# EAGLE design merch-hat (EAGLE 9.2.0)
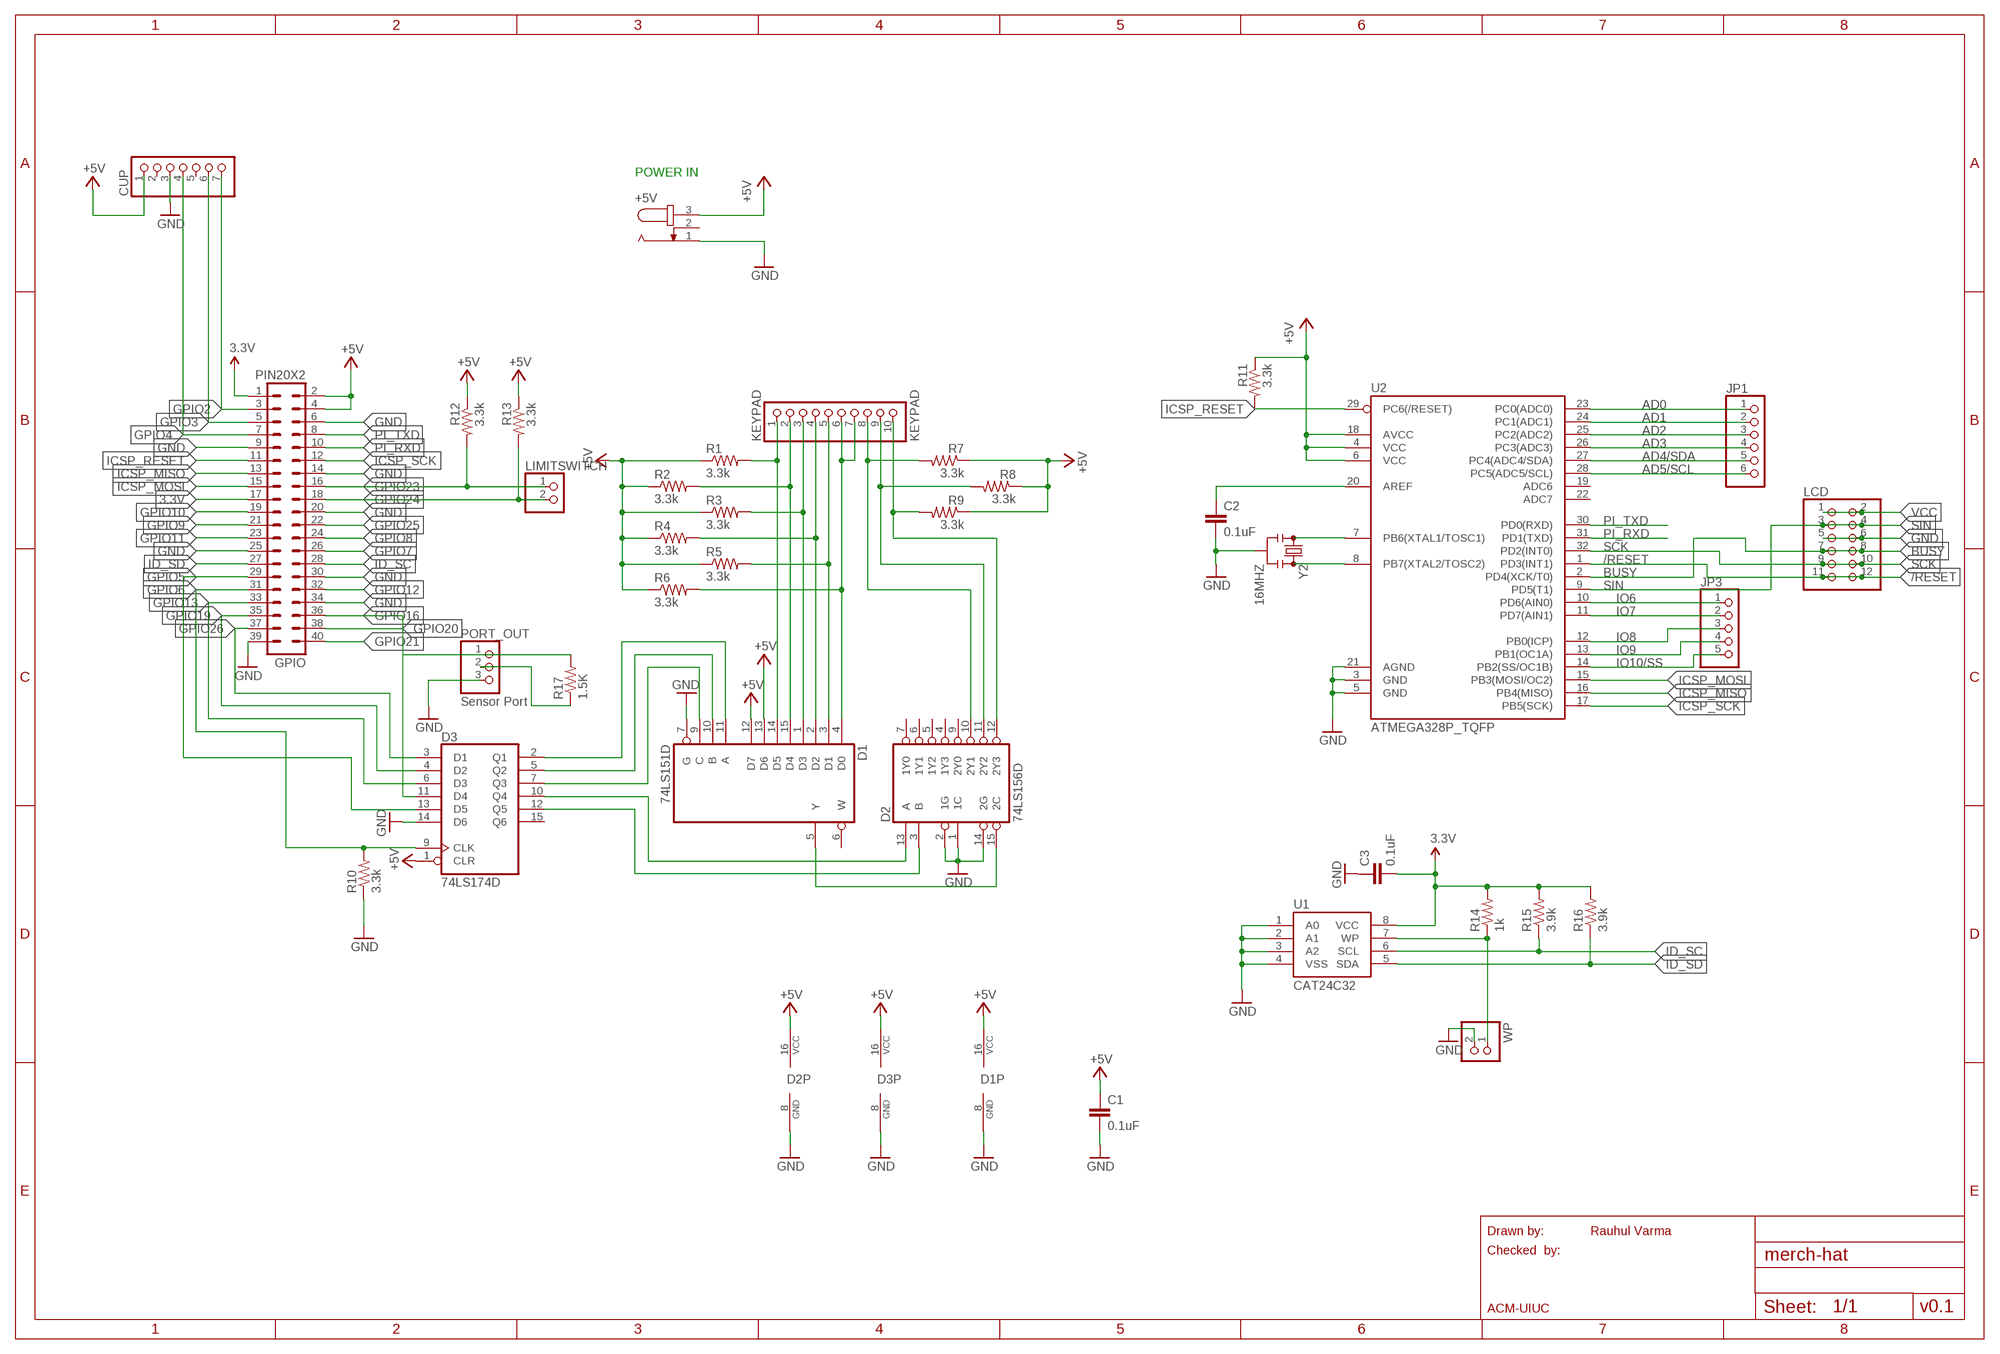
[diagram p0: schematic, sheet 1]

## Parts
+5V  JACK-PLUG1  [SPC4078]
C1  0.1uF  CAP0603-CAP  [0603-CAP]
C2  0.1uF  CAP0603-CAP  [0603-CAP]
C3  0.1uF  CAP0603-CAP  [0603-CAP]
CUP  PINHD-1X7  [1X07]
D1  74LS151D  [SO16]
D2  74LS156D  [SO16]
D3  74LS174D  [SO16]
GPIO  PIN20X2  [PIN_20X2]
JP1  PINHD-1X6  [1X06]
JP3  PINHD-1X5  [1X05]
KEYPAD  KEYPAD  PINHD-1X10  [1X10]
LCD  PINHD-2X6  [2X06]
LIMITSWITCH  PINHD-1X2  [1X02]
PORT_OUT  Sensor Port  PINHD-1X3  [1X03]
R1  3.3k  RESISTOR0603  [0603-RES]
R2  3.3k  RESISTOR0603  [0603-RES]
R3  3.3k  RESISTOR0603  [0603-RES]
R4  3.3k  RESISTOR0603  [0603-RES]
R5  3.3k  RESISTOR0603  [0603-RES]
R6  3.3k  RESISTOR0603  [0603-RES]
R7  3.3k  RESISTOR0603  [0603-RES]
R8  3.3k  RESISTOR0603  [0603-RES]
R9  3.3k  RESISTOR0603  [0603-RES]
R10  3.3k  RESISTOR0603  [0603-RES]
R11  3.3k  RESISTOR0603  [0603-RES]
R12  3.3k  RESISTOR0603  [0603-RES]
R13  3.3k  RESISTOR0603  [0603-RES]
R14  1k  RESISTOR0603-RES  [0603-RES]
R15  3.9k  RESISTOR0603-RES  [0603-RES]
R16  3.9k  RESISTOR0603-RES  [0603-RES]
R17  1.5K  R-US_R0603  [R0603]
U1  CAT24C32  [SO08]
U2  ATMEGA328P_TQFP  [TQFP32-08]
WP  PINHD-1X2  [1X02]
Y2  16MHZ  RESONATOR16MHZ  [RESONATOR-SMD]

## Nets
3.3V: C3.2 GPIO.1 GPIO.17 R14.2 R15.2 R16.2 U1.8(VCC)
+5V: +5V.3 C1.1 CUP.1 D1.12(D7) D1.13(D6) D1.16(VCC) D2.16(VCC) D3.1(CLR) D3.16(VCC) GPIO.2 GPIO.4 R1.1 R2.1 R3.1 R4.1 R5.1 R6.1 R7.1 R8.1 R9.1 R11.1 R12.1 R13.1 U2.4(VCC) U2.6(VCC) U2.18(AVCC)
/RESET: LCD.11 LCD.12 U2.1(PD3(INT1))
AD0: JP1.1 U2.23(PC0(ADC0))
AD1: JP1.2 U2.24(PC1(ADC1))
AD2: JP1.3 U2.25(PC2(ADC2))
AD3: JP1.4 U2.26(PC3(ADC3))
AD4/SDA: JP1.5 U2.27(PC4(ADC4/SDA))
AD5/SCL: JP1.6 U2.28(PC5(ADC5/SCL))
BUSY: LCD.7 LCD.8 U2.2(PD4(XCK/T0))
GND: +5V.1 C1.2 C2.2 C3.1 CUP.3 D1.7(G) D1.8(GND) D2.1(1C) D2.2(1G) D2.8(GND) D2.14(2G) D3.8(GND) D3.14(D6) GPIO.6 GPIO.9 GPIO.14 GPIO.20 GPIO.25 GPIO.30 GPIO.34 GPIO.39 LCD.5 LCD.6 PORT_OUT.3 R10.1 U1.1(A0) U1.2(A1) U1.3(A2) U1.4(VSS) U2.3(GND) U2.5(GND) U2.21(AGND) WP.2 Y2.2
GPIO2: CUP.7 GPIO.3
GPIO3: CUP.6 GPIO.5
GPIO4: CUP.4 GPIO.7
GPIO5: D3.13(D5) GPIO.29
GPIO6: D3.9(CLK) GPIO.31 R10.2
GPIO7: GPIO.26
GPIO8: GPIO.24
GPIO9: GPIO.21
GPIO10: GPIO.19
GPIO11: GPIO.23
GPIO12: GPIO.32
GPIO13: D3.6(D3) GPIO.33
GPIO16: D3.11(D4) GPIO.36
GPIO19: D3.4(D2) GPIO.35
GPIO20: GPIO.38 PORT_OUT.1 R17.2
GPIO21: GPIO.40
GPIO23: GPIO.16 LIMITSWITCH.1 R12.2
GPIO24: GPIO.18 LIMITSWITCH.2 R13.2
GPIO25: GPIO.22
GPIO26: D3.3(D1) GPIO.37
ICSP_MISO: GPIO.13 U2.16(PB4(MISO))
ICSP_MOSI: GPIO.15 U2.15(PB3(MOSI/OC2))
ICSP_RESET: GPIO.11 R11.2 U2.29(PC6(/RESET))
ICSP_SCK: GPIO.12 U2.17(PB5(SCK))
ID_SC: GPIO.28 R15.1 U1.6(SCL)
ID_SD: GPIO.27 R16.1 U1.5(SDA)
IO6: JP3.1 U2.10(PD6(AIN0))
IO7: JP3.2 U2.11(PD7(AIN1))
IO8: JP3.3 U2.12(PB0(ICP))
IO9: JP3.4 U2.13(PB1(OC1A))
IO10/SS: JP3.5 U2.14(PB2(SS/OC1B))
N$1: D1.14(D5) KEYPAD.1 R1.2
N$2: R14.1 U1.7(WP) WP.1
N$3: PORT_OUT.2 R17.1
N$4: D1.15(D4) KEYPAD.2 R2.2
N$9: D1.1(D3) KEYPAD.3 R3.2
N$10: D1.2(D2) KEYPAD.4 R4.2
N$11: D1.3(D1) KEYPAD.5 R5.2
N$12: D1.11(A) D3.2(Q1)
N$13: D1.4(D0) KEYPAD.6 KEYPAD.7 R6.2
N$14: D2.10(2Y1) KEYPAD.8 R7.2
N$15: D2.11(2Y2) KEYPAD.9 R8.2
N$16: D2.12(2Y3) KEYPAD.10 R9.2
N$17: D1.10(B) D3.5(Q2)
N$18: D1.9(C) D3.7(Q3)
N$20: D2.13(A) D3.10(Q4)
N$21: D2.3(B) D3.12(Q5)
N$22: D1.5(Y) D2.15(2C)
N$29: U2.7(PB6(XTAL1/TOSC1)) Y2.1
N$30: U2.8(PB7(XTAL2/TOSC2)) Y2.3
N$32: C2.1 U2.20(AREF)
PI_RXD: GPIO.10 U2.31(PD1(TXD))
PI_TXD: GPIO.8 U2.30(PD0(RXD))
SCK: LCD.9 LCD.10 U2.32(PD2(INT0))
SIN: LCD.3 LCD.4 U2.9(PD5(T1))
VCC: LCD.1 LCD.2
Unconnected: +5V.2 CUP.2 CUP.5 D1.6(W) D2.4(1Y3) D2.5(1Y2) D2.6(1Y1) D2.7(1Y0) D2.9(2Y0) D3.15(Q6) U2.19(ADC6) U2.22(ADC7)

## Notes on the sheet
- POWER IN
- Drawn by: | Rauhul Varma
- Checked  by:
- ACM-UIUC | v0.1

## Library data of the parts
+5V = con-jack:JACK-PLUG: DC POWER JACK Power Jack, DC, Right Angle, Through Hole, Rated 5A at 16VDC, PC Terminals Distributor: Farnell (www.Farnell.de) Drawing: 84N1161.pdf / 84N1162.pdf Manufacturer: SPC Technology (www.spctechnology.com) Type: SPC4077 / SPC 4078; OC_FARNELL: unknown; OC_NEWARK: unknown
C1 C2 = SparkFun-Capacitors:CAP: Capacitor Standard 0603 ceramic capacitor, and 0.1" leaded capacitor.
C3 = merch-hardware:CAP: Capacitor Standard 0603 ceramic capacitor, and 0.1" leaded capacitor.
CUP = pinhead:PINHD-1X7: PIN HEADER
D1 = 74xx-us:74*151: Data SELECTOR/MULTIPLEXER
D2 = 74xx-us:74*156: Dual 2-line to 4-line DECODER/DEMULTIPLEXER
D3 = 74xx-us:74*174: Hex D type FLIP FLOP, clear
GPIO = FLYFISH:PIN20X2
JP1 = pinhead:PINHD-1X6: PIN HEADER
JP3 = pinhead:PINHD-1X5: PIN HEADER
KEYPAD = pinhead:PINHD-1X10: PIN HEADER
LCD = pinhead:PINHD-2X6: PIN HEADER
LIMITSWITCH WP = pinhead:PINHD-1X2: PIN HEADER
PORT_OUT = pinhead:PINHD-1X3: PIN HEADER
R1-R16 = merch-hardware:RESISTOR: Resistor Basic schematic elements and footprints for 0603, 1206, and PTH resistors.
R17 = rcl:R-US_: RESISTOR, American symbol; SPICEPREFIX: R
U1 = merch-hardware:CAT24C32
U2 = SparkFun-DigitalIC:ATMEGA328P_TQFP; PROD_ID: IC-09069
Y2 = SparkFun-FreqCtrl:RESONATOR: Resonator Small SMD resonator. Used, eg, on the Arduino Pro/ Pro Mini boards. 8MHz- XTAL-08895 16MHz- XTAL-08900; PROD_ID: XTAL-08900

## Board
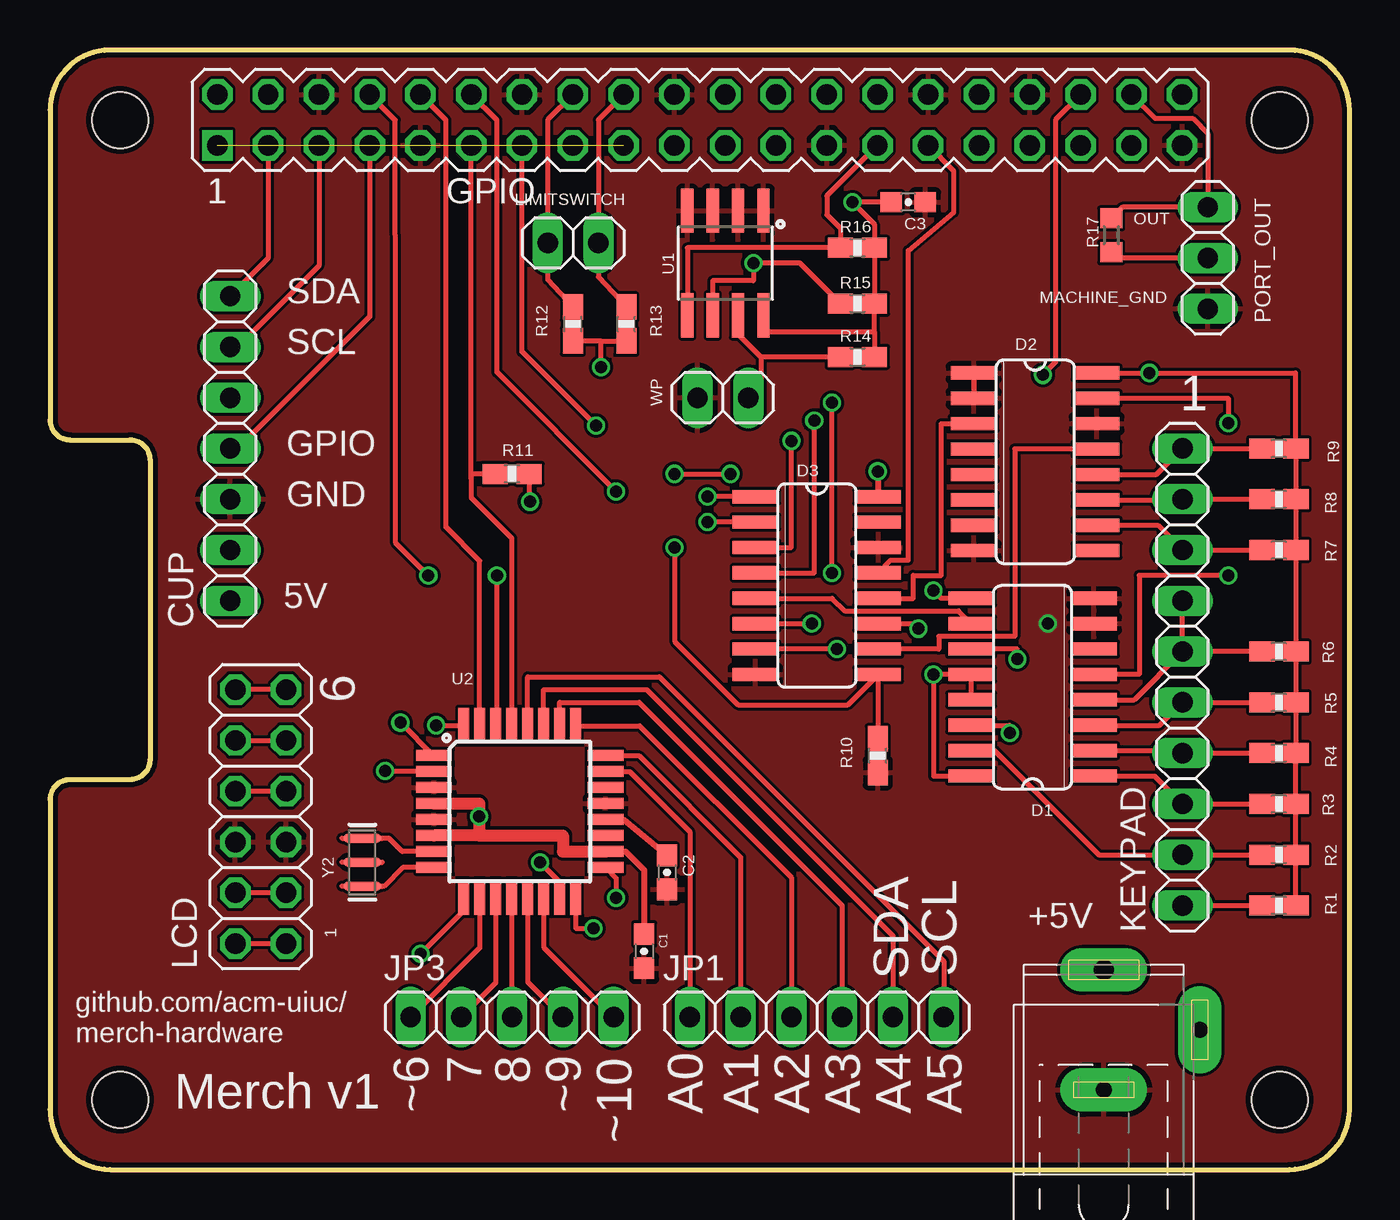
[diagram p1: board, top side]
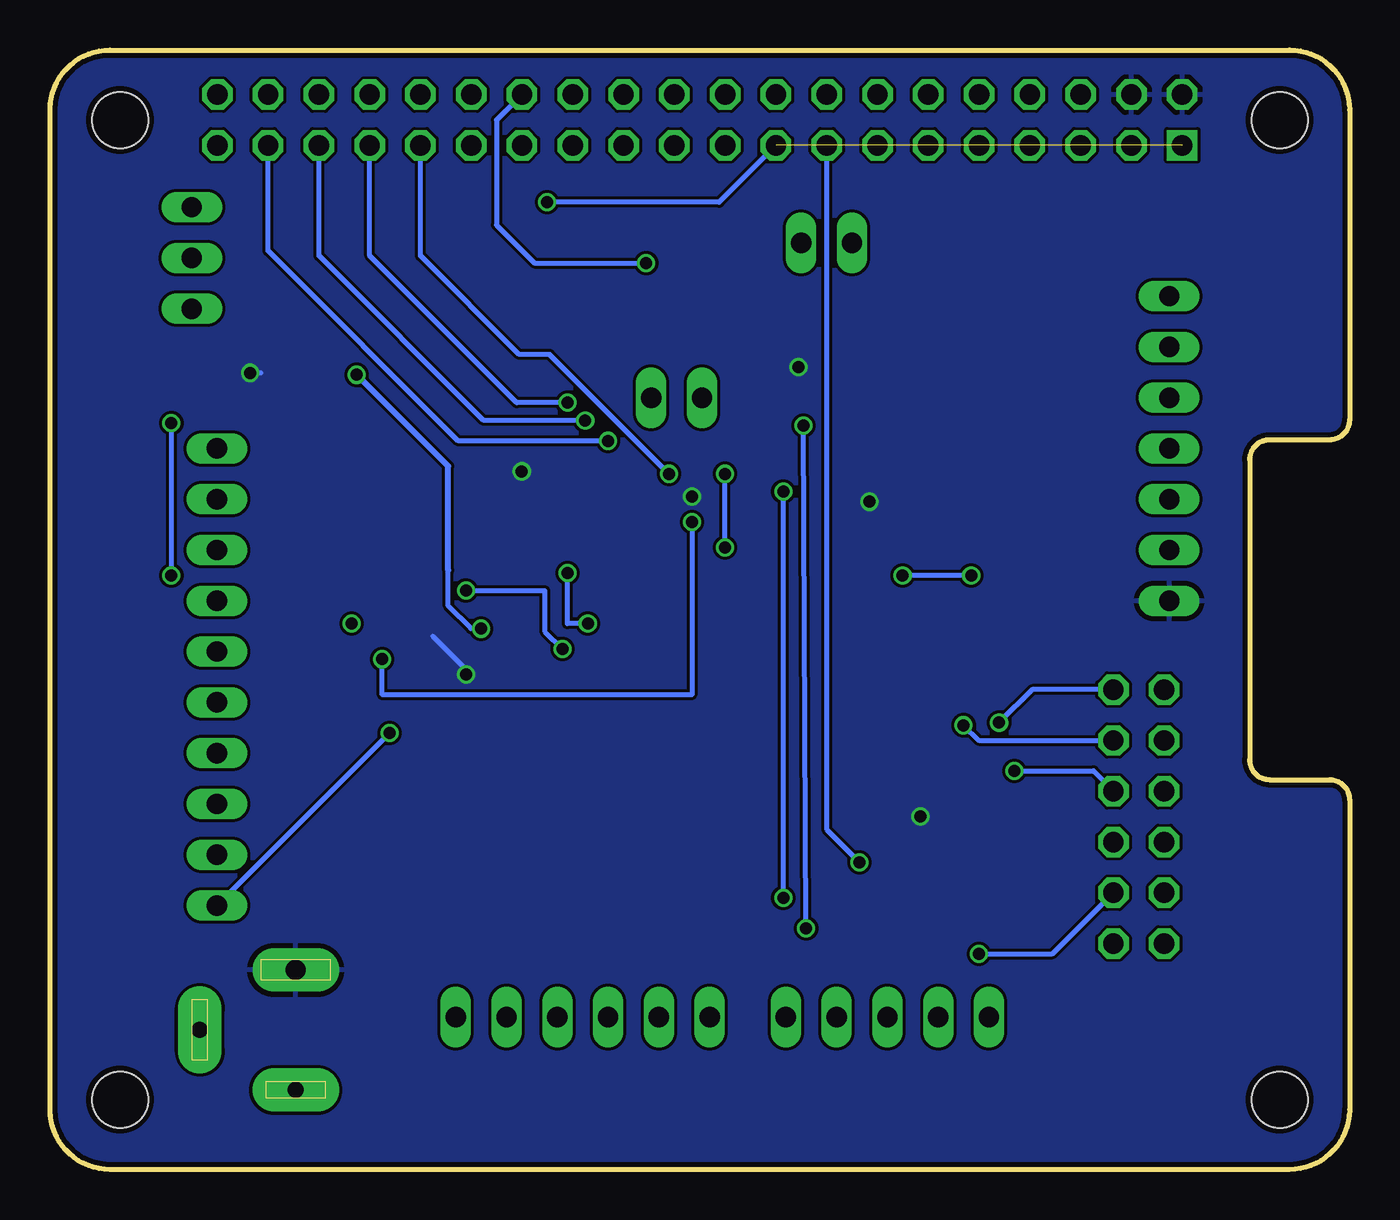
[diagram p2: board, bottom side, seen from below]

Size 65 x 56 mm. Coordinates in mm from the lower left corner, seen from the top.
Outline: 0,3 arc90 3,0 62,0 arc90 65,3 65,53 arc90 62,56 3,56 arc90 0,53 0,37.5 arc90 1,36.5 4,36.5 arc-90 5,35.5 5,20.5 arc-90 4,19.5 1,19.5 arc90 0,18.5 0,3
Copper layers (1*16): Top 0.035mm / dielectric 1.5mm / Bottom 0.035mm
Design rules "SeeedStudio_2layer": minimum track width 6mil, minimum drill 12mil, track to track 6mil, track to pad 6mil, pad to pad 6mil, via to via 6mil, smd to smd 0mil, copper to edge 10mil, drill to drill 10mil, minimum pad ring 10mil, minimum via ring 6mil, stop-mask expansion 2mil, vias tented up to drill 100mil, thermal gap 10mil
Holes 2.8 mm at 3.5,3.5 3.5,52.5 61.5,52.5 61.5,3.5
tRestrict: area 1.9,51 to 5,54; area 60,51 to 63,54; area 60,1.9 to 63,5; area 1.9,1.9 to 5,5
bRestrict: area 1.9,1.9 to 5,5; area 1.9,51 to 5,54; area 60,1.9 to 63,5; area 60,51 to 63,54

### Footprints (pad centres in the part's own frame; a part is rotated, then mirrored left to right if it is on the bottom)
SPC4078 = drill 0.8 pad 2.184 long: 1 -3,0; 2 0,-4.8 | drill 1 pad 2.184 long: 3 3,0
0603-CAP = smd 1.092 x 1: 1 -0.85,0; 2 0.85,0
1X07 = drill 1.016 long: 1 -7.62,0; 2 -5.08,0; 3 -2.54,0; 4 0,0; 5 2.54,0; 6 5.08,0; 7 7.62,0
SO16 = smd 0.66 x 2.286: 1 -4.445,-3.073; 2 -3.175,-3.073; 3 -1.905,-3.073; 4 -0.635,-3.073; 5 0.635,-3.073; 6 1.905,-3.073; 7 3.175,-3.073; 8 4.445,-3.073; 9 4.445,3.073; 10 3.175,3.073; 11 1.905,3.073; 12 0.635,3.073; 13 -0.635,3.073; 14 -1.905,3.073; 15 -3.175,3.073; 16 -4.445,3.073
PIN_20X2 = drill 1.016 square: 1 -24.13,-1.27 | drill 1.016 octagon: 2 -24.13,1.27; 3 -21.59,-1.27; 4 -21.59,1.27; 5 -19.05,-1.27; 6 -19.05,1.27; 7 -16.51,-1.27; 8 -16.51,1.27; 9 -13.97,-1.27; 10 -13.97,1.27; 11 -11.43,-1.27; 12 -11.43,1.27; 13 -8.89,-1.27; 14 -8.89,1.27; 15 -6.35,-1.27; 16 -6.35,1.27; 17 -3.81,-1.27; 18 -3.81,1.27; 19 -1.27,-1.27; 20 -1.27,1.27; 21 1.27,-1.27; 22 1.27,1.27; 23 3.81,-1.27; 24 3.81,1.27; 25 6.35,-1.27; 26 6.35,1.27; 27 8.89,-1.27; 28 8.89,1.27; 29 11.43,-1.27; 30 11.43,1.27; 31 13.97,-1.27; 32 13.97,1.27; 33 16.51,-1.27; 34 16.51,1.27; 35 19.05,-1.27; 36 19.05,1.27; 37 21.59,-1.27; 38 21.59,1.27; 39 24.13,-1.27; 40 24.13,1.27
1X06 = drill 1.016 long: 1 -6.35,0; 2 -3.81,0; 3 -1.27,0; 4 1.27,0; 5 3.81,0; 6 6.35,0
1X05 = drill 1.016 long: 1 -5.08,0; 2 -2.54,0; 3 0,0; 4 2.54,0; 5 5.08,0
1X10 = drill 1.016 long: 1 -11.43,0; 2 -8.89,0; 3 -6.35,0; 4 -3.81,0; 5 -1.27,0; 6 1.27,0; 7 3.81,0; 8 6.35,0; 9 8.89,0; 10 11.43,0
2X06 = drill 1.016 octagon: 1 -6.35,-1.27; 2 -6.35,1.27; 3 -3.81,-1.27; 4 -3.81,1.27; 5 -1.27,-1.27; 6 -1.27,1.27; 7 1.27,-1.27; 8 1.27,1.27; 9 3.81,-1.27; 10 3.81,1.27; 11 6.35,-1.27; 12 6.35,1.27
1X02 = drill 1.016 long: 1 -1.27,0; 2 1.27,0
1X03 = drill 1.016 long: 1 -2.54,0; 2 0,0; 3 2.54,0
0603-RES = smd 1.27 x 1: 1 -0.85,0; 2 0.85,0
R0603 = smd 1 x 1.1: 1 -0.85,0; 2 0.85,0
SO08 = smd 0.61 x 2.21: 1 -1.905,-2.616; 2 -0.635,-2.616; 3 0.635,-2.616; 4 1.905,-2.616; 5 1.905,2.616; 6 0.635,2.616; 7 -0.635,2.616; 8 -1.905,2.616
TQFP32-08 = smd 1.778 x 0.559: 1 -4.293,2.8; 2 -4.293,2; 3 -4.293,1.2; 4 -4.293,0.4; 5 -4.293,-0.4; 6 -4.293,-1.2; 7 -4.293,-2; 8 -4.293,-2.8; 17 4.293,-2.8; 18 4.293,-2; 19 4.293,-1.2; 20 4.293,-0.4; 21 4.293,0.4; 22 4.293,1.2; 23 4.293,2; 24 4.293,2.8 | smd 0.559 x 1.778: 9 -2.8,-4.293; 10 -2,-4.293; 11 -1.2,-4.293; 12 -0.4,-4.293; 13 0.4,-4.293; 14 1.2,-4.293; 15 2,-4.293; 16 2.8,-4.293; 25 2.8,4.293; 26 2,4.293; 27 1.2,4.293; 28 0.4,4.293; 29 -0.4,4.293; 30 -1.2,4.293; 31 -2,4.293; 32 -2.8,4.293
RESONATOR-SMD = smd 0.45 x 1.905: 1 -1.2,0; 2 0,0; 3 1.2,0

### Placement (x,y rotation side)
+5V  52.7,6.99 90 top
C1  29.72,10.92 270 top
C2  30.86,14.86 270 top
C3  42.93,48.39 180 top
CUP  9.02,36.07 90 top
D1  49.15,24.13 90 top
D2  49.28,35.4 270 top
D3  38.35,29.21 270 top
GPIO  32.5,52.5 0 top
JP1  38.35,7.62 0 top
JP3  23.11,7.62 0 top
KEYPAD  56.64,24.64 90 top
LCD  10.54,17.65 90 top
LIMITSWITCH  26.16,46.35 0 top
PORT_OUT  57.91,45.59 270 top
R1  61.47,13.21 180 top
R2  61.47,15.75 180 top
R3  61.47,18.29 180 top
R4  61.47,20.83 180 top
R5  61.47,23.37 180 top
R6  61.47,25.91 180 top
R7  61.47,30.99 180 top
R8  61.47,33.53 180 top
R9  61.47,36.07 180 top
R10  41.4,20.7 90 top
R11  23.11,34.8 180 top
R12  26.16,42.29 90 top
R13  28.83,42.29 90 top
R14  40.39,40.64 0 top
R15  40.39,43.31 0 top
R16  40.39,46.1 0 top
R17  53.09,46.74 90 top
U1  33.78,45.34 180 top
U2  23.5,17.91 0 top
WP  33.66,38.61 180 top
Y2  15.62,15.37 270 top

### Tracks (layer width: path | path; a pad name or v marks a point on that pad's centre or on a via)
3.3V  (via drill 0.6)  (1 unrouted)
  Top 0.254: C3.2 v40.13,48.39 41.24,47.28 R16.2 R15.2 41.24,41.91 | 41.24,41.91 R14.2 | U1.8 35.69,41.91 41.24,41.91
  Bottom 0.254: GPIO.17 31.53,48.39 v40.13,48.39
+5V  (via drill 0.6)
  Top 0.254: D1.13 D1.12 v44.2,24.77 44.2,19.68 D1.16 | R1.1 R2.1 R3.1 R4.1 R5.1 R6.1 R7.1 R8.1 R9.1 62.29,36.09 62.29,39.85 v54.99,39.85 D2.16 | 27.56,41.44 R12.1 | 27.56,41.44 R13.1 | D3.1 v32.89,33.66 | R11.1 23.96,33.4 v24,33.4 | v27.56,40.13 27.56,41.44
  Top 0.305: U2.18 28.8,15.91 29.72,14.99 C1.1 | v41.4,34.92 41.4,33.66 D3.16
  Top 0.61: U2.18 25.65,15.91 25.65,16.71 21.46,16.71 | 21.46,16.71 U2.6 | U2.4 21.46,18.31 v21.46,17.65 21.46,16.71
  Bottom 0.254: 45.85,26.67 44.2,25.02 v44.2,24.77 | 54.45,39.85 v54.99,39.85
  pour Bottom: 0,3 arc90 3,0 62,0 arc90 65,3 65,53 arc90 62,56 3,56 arc90 0,53 0,37.5 arc90 1,36.5 4,36.5 arc-90 5,35.5 5,20.5 arc-90 4,19.5 1,19.5 arc90 0,18.5
/RESET  (via drill 0.6)
  Top 0.254: LCD.11 LCD.12 | v17.53,22.35 19.17,20.71 U2.1
  Bottom 0.254: LCD.11 15.88,24 v17.53,22.35
AD0
  Top 0.254: U2.23 28.99,19.91 32,16.89 JP1.1
AD1
  Top 0.254: U2.24 29.46,20.71 34.54,15.62 JP1.2
AD2
  Top 0.254: U2.25 29.49,22.2 37.08,14.61 JP1.3
AD3
  Top 0.254: U2.26 25.5,23.37 29.46,23.37 39.62,13.21 JP1.4
AD4/SDA
  Top 0.254: U2.27 24.7,24 29.84,24 42.16,11.68 JP1.5
AD5/SCL
  Top 0.254: U2.28 23.89,24.64 30.48,24.64 44.7,10.41 JP1.6
BUSY  (via drill 0.6)
  Top 0.254: LCD.7 LCD.8 | U2.2 16.76,19.91 v16.76,19.94
  Bottom 0.254: LCD.7 12.79,19.91 12.79,19.94 v16.76,19.94
GND  (via drill 0.6)
  Top 0.254: D2.1 D2.2
  other vias: 49.91,27.3
  pour Top: 0,3 arc90 3,0 62,0 arc90 65,3 65,53 arc90 62,56 3,56 arc90 0,53 0,37.5 arc90 1,36.5 4,36.5 arc-90 5,35.5 5,20.5 arc-90 4,19.5 1,19.5 arc90 0,18.5
GPIO2
  Top 0.254: GPIO.3 10.91,45.58 CUP.7
GPIO3
  Top 0.254: GPIO.5 13.45,45.2 9.4,41.15 CUP.6
GPIO4
  Top 0.254: GPIO.7 15.99,42.66 9.4,36.07 CUP.4
GPIO5
  Top 0.254: D3.13 42.06,30.48 42.93,30.48 42.93,45.97 45.21,47.88 45.21,49.95 GPIO.29
GPIO6  (via drill 0.6)
  Top 0.254: R10.2 41.4,24.74 D3.9 39.9,23.24 34.42,23.24 31.24,26.42 v31.24,31.11 | v31.24,34.8 v34.04,34.8
  Bottom 0.254: v31.24,31.11 v31.24,34.8 | GPIO.31 46.47,45.71 41.53,40.77 40.01,40.77 v34.04,34.8
GPIO13  (via drill 0.6)
  Top 0.254: D3.6 v38.1,27.3 | v39.12,29.84 v39.12,38.35
  Bottom 0.254: v38.1,27.3 39.12,27.3 v39.12,29.84 | GPIO.33 49.01,45.71 41.66,38.35 v39.12,38.35
GPIO16  (via drill 0.6)
  Top 0.254: D3.11 43.18,27.3 v43.43,27.05 | GPIO.36 50.29,52.51 50.29,40.39 v49.66,39.75
  Bottom 0.254: v43.43,27.05 43.94,27.05 45.09,28.19 45.09,29.97
  Bottom 0.305: 45.09,29.97 45.09,35.18 v49.66,39.75
GPIO19  (via drill 0.6)
  Top 0.254: D3.4 38.23,29.84 v38.23,37.47
  Bottom 0.254: GPIO.35 51.55,45.71 43.31,37.47 v38.23,37.47
GPIO20
  Top 0.254: GPIO.38 55.28,52.58 57.15,52.58 57.91,51.82 PORT_OUT.1 53.63,48.13 R17.2
GPIO23
  Top 0.254: GPIO.16 24.89,52.51 LIMITSWITCH.1 24.89,44.51 R12.2
GPIO24
  Top 0.254: GPIO.18 27.43,52.51 LIMITSWITCH.2 27.43,44.64 R13.2
GPIO26  (via drill 0.6)
  Top 0.254: D3.3 37.08,31.11 v37.08,36.45
  Bottom 0.254: GPIO.37 54.09,45.96 44.58,36.45 v37.08,36.45
ICSP_MISO  (via drill 0.6)
  Top 0.254: U2.16 26.3,12.06 v27.18,12.06 | GPIO.13 23.61,40.91 v27.3,37.21
  Bottom 0.254: v27.18,12.06 v27.3,37.21
ICSP_MOSI  (via drill 0.6)
  Top 0.254: U2.15 25.5,14.38 v24.51,15.37
  Bottom 0.254: v24.51,15.37 26.16,17.02 26.16,51.22 GPIO.15
ICSP_RESET
  Top 0.254: 21.07,34.54 GPIO.11 | 21.07,34.54 21.07,33.61 23.09,31.58 U2.29 | R11.2 21.07,34.8 21.07,34.54
ICSP_SCK  (via drill 0.6)
  Top 0.254: U2.17 28.32,14.57 v28.32,13.59 | v28.32,33.91 22.35,39.88 22.35,52.49 GPIO.12
  Bottom 0.254: v28.32,13.59 v28.32,33.91
ID_SC  (via drill 0.6)
  Top 0.254: U1.6 33.15,44.45 35.18,44.45 v35.18,45.34 37.5,45.34 R15.1
  Bottom 0.254: GPIO.28 42.67,52.49 42.67,47.24 40.77,45.34 v35.18,45.34
ID_SD
  Top 0.254: U1.5 31.88,46.1 R16.1 39.54,47.08 38.86,47.75 38.86,48.7 GPIO.27
IO6
  Top 0.254: U2.10 21.5,11.08 JP3.1
IO7
  Top 0.254: U2.11 22.3,9.34 JP3.2
IO8
  Top 0.254: U2.12 23.09,7.64 JP3.3
IO9
  Top 0.254: U2.13 23.89,9.38 JP3.4
IO10/SS
  Top 0.254: U2.14 24.7,11.12 JP3.5
N$1  (via drill 0.6)
  Top 0.254: KEYPAD.1 R1.2 | D1.14 48.01,22.23 v48.01,21.84
  Bottom 0.254: v48.01,21.84 KEYPAD.1
N$2
  Top 0.254: 35.56,40.64 34.42,41.78 U1.7 | 35.56,40.64 35.56,39.24 WP.1 | R14.1 35.56,40.64
N$3
  Top 0.254: PORT_OUT.2 53.38,45.59 R17.1
N$4
  Top 0.254: D1.15 47.24,20.95 52.45,15.75 KEYPAD.2 R2.2
N$9
  Top 0.254: D1.1 55.24,19.68 KEYPAD.3 R3.2
N$10
  Top 0.254: D1.2 56.52,20.95 KEYPAD.4 R4.2
N$11
  Top 0.254: D1.3 55.5,22.23 KEYPAD.5 R5.2
N$12  (via drill 0.6)
  Top 0.254: D3.2 v32.89,32.38 | v48.39,25.53 48.39,26.04 D1.11
  Bottom 0.254: v48.39,25.53 48.39,23.75 32.89,23.75 v32.89,32.38
N$13
  Top 0.254: D1.4 54.23,23.5 KEYPAD.6 | KEYPAD.6 KEYPAD.7 | R6.2 KEYPAD.6
N$14
  Top 0.254: D2.10 55.4,32.23 KEYPAD.8 R7.2
N$15
  Top 0.254: D2.11 56.61,33.5 KEYPAD.9 R8.2
N$16
  Top 0.254: D2.12 55.34,34.77 KEYPAD.10 R9.2
N$17
  Top 0.254: D3.5 39.12,28.57 39.75,27.94 45.44,27.94 D1.10
N$18  (via drill 0.6)
  Top 0.254: D1.9 44.58,28.57 v44.2,28.96 | v39.37,26.04 D3.7
  Bottom 0.254: v44.2,28.96 40.26,28.96 40.26,26.92 v39.37,26.04
N$20
  Top 0.254: D2.13 48.26,36.04 48.26,26.67 44.45,26.67 44.45,26.04 D3.10
N$21
  Top 0.254: D3.12 43.18,28.57 43.18,29.72 44.58,29.72 44.58,37.31 D2.3
N$22  (via drill 0.6)
  Top 0.254: v58.93,29.72 54.48,29.72 54.48,24.77 D1.5 | v58.93,37.34 58.93,37.31 58.93,38.58 D2.15
  Bottom 0.254: v58.93,37.34 v58.93,29.72
N$29
  Top 0.254: U2.7 17.62,15.91 16.96,16.57 Y2.1
N$30
  Top 0.254: U2.8 17.65,15.11 16.71,14.17 Y2.3
N$32
  Top 0.305: U2.20 28.68,17.51 C2.1
PI_RXD
  Top 0.254: U2.31 21.5,30.45 19.81,32.13 19.81,52.49 GPIO.10
PI_TXD  (via drill 0.6)
  Top 0.254: v18.92,29.72 17.27,31.37 17.27,46.74 17.27,52.49 GPIO.8 | U2.30 22.35,22.26 v22.35,29.72
  Bottom 0.254: v18.92,29.72 v22.35,29.72
SCK  (via drill 0.6)
  Top 0.254: LCD.10 LCD.9 | U2.32 19.3,22.2 v19.3,22.23
  Bottom 0.254: v19.3,22.23 18.54,21.46 LCD.9
SIN  (via drill 0.6)
  Top 0.254: LCD.3 LCD.4 | U2.9 20.7,12.95 v18.54,10.79
  Bottom 0.254: v18.54,10.79 14.86,10.79 LCD.3
VCC
  Top 0.254: LCD.2 LCD.1

### Text on the board
tPlace: OUT | MACHINE_GND | SDA | SCL | 1 | GPIO | GND | 5V | 6 | 1 | SDA | SCL | github.com/acm-uiuc/ / merch-hardware | ~6 | 7 | 8 | ~9 | ~10 | Merch v1 | A0 | A1 | A2 | A3 | A4 | A5